# EAGLE design Novo_Container (EAGLE 9.0.1)
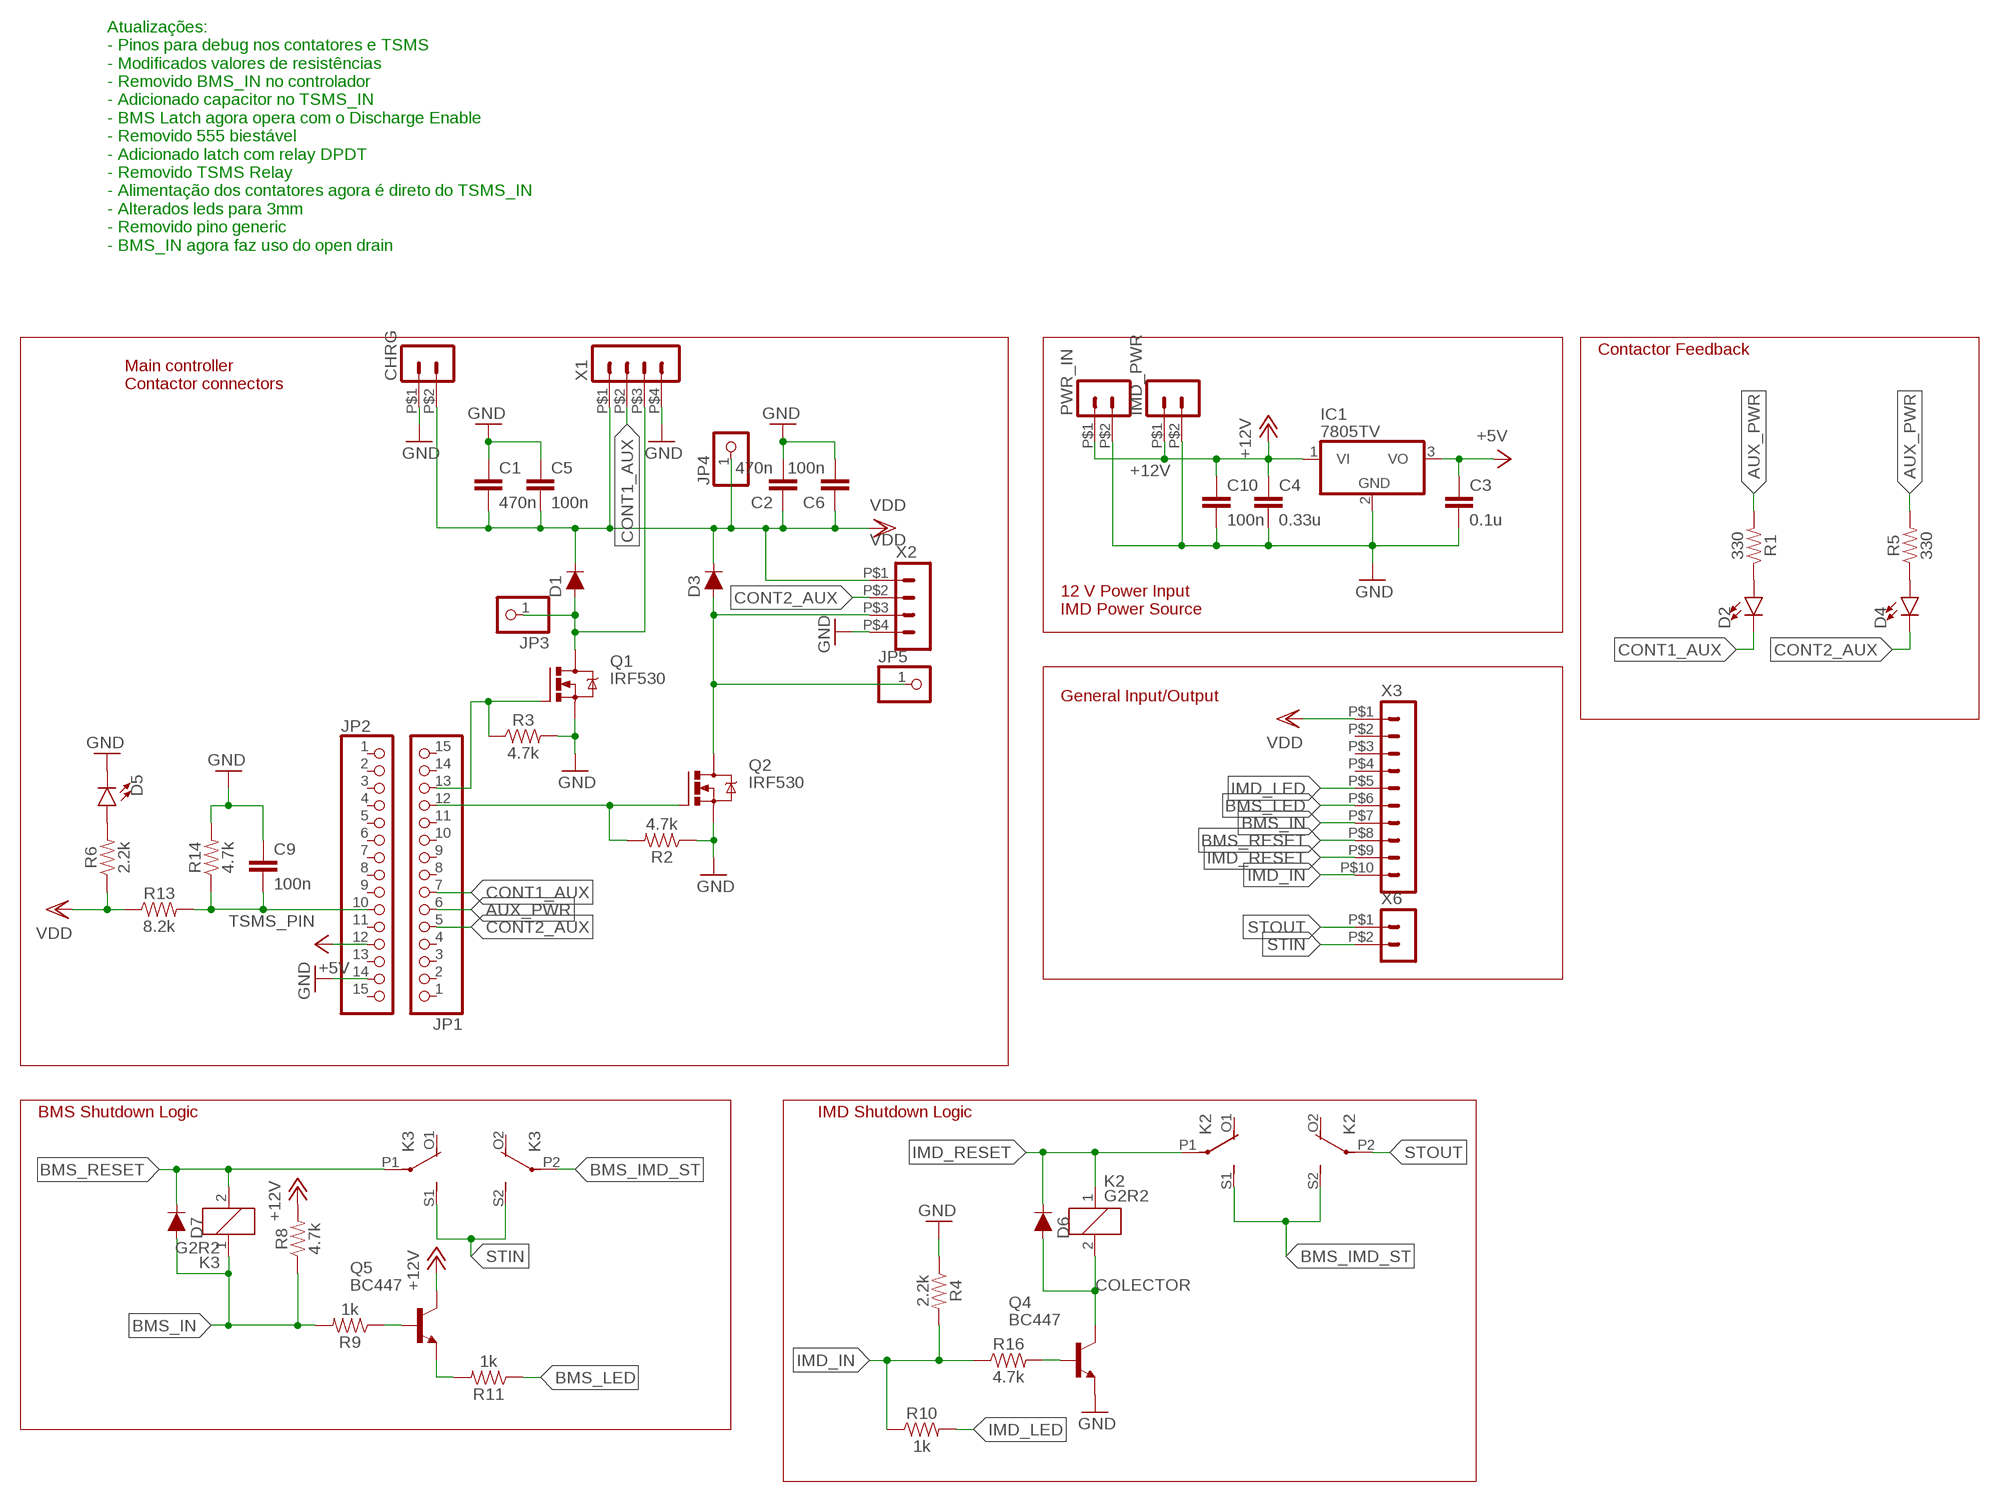
[diagram p0: schematic, sheet 1]

## Parts
C1  470n  C-EU025-025X050  [C025-025X050]
C2  470n  C-EU025-025X050  [C025-025X050]
C3  0.1u  C-EU025-025X050  [C025-025X050]
C4  0.33u  C-EU025-025X050  [C025-025X050]
C5  100n  C-EU025-025X050  [C025-025X050]
C6  100n  C-EU025-025X050  [C025-025X050]
C9  100n  C-EU025-025X050  [C025-025X050]
C10  100n  C-EU025-025X050  [C025-025X050]
CHRG  HEADER_POS2_43650-0200  [43650-0200]
D1  DIODE-1N4148  [DIODE-1N4148]
D2  LED3MM  [LED_3MM]
D3  DIODE-1N4148  [DIODE-1N4148]
D4  LED3MM  [LED_3MM]
D5  LED3MM  [LED_3MM]
D6  DIODE-1N4148  [DIODE-1N4148]
D7  DIODE-1N4148  [DIODE-1N4148]
IC1  7805TV  [TO220V]
IMD_PWR  HEADER_POS2_43650-0200  [43650-0200]
JP1  PINHD-1X15  [1X15]
JP2  PINHD-1X15  [1X15]
JP3  PINHD-1X1  [1X01]
JP4  PINHD-1X1  [1X01]
JP5  PINHD-1X1  [1X01]
K2  G2R2  [G2R2]
K3  G2R2  [G2R2]
PWR_IN  HEADER_POS2_43650-0200  [43650-0200]
Q1  IRF530  [TO220BV]
Q2  IRF530  [TO220BV]
Q4  BC447  [TO92-EBC]
Q5  BC447  [TO92-EBC]
R1  330  RESISTORAXIAL-0.3  [AXIAL-0.3]
R2  4.7k  RESISTORAXIAL-0.3  [AXIAL-0.3]
R3  4.7k  RESISTORAXIAL-0.3  [AXIAL-0.3]
R4  2.2k  RESISTORAXIAL-0.3  [AXIAL-0.3]
R5  330  RESISTORAXIAL-0.3  [AXIAL-0.3]
R6  2.2k  RESISTORAXIAL-0.3  [AXIAL-0.3]
R8  4.7k  RESISTORAXIAL-0.3  [AXIAL-0.3]
R9  1k  RESISTORAXIAL-0.3  [AXIAL-0.3]
R10  1k  RESISTORAXIAL-0.3  [AXIAL-0.3]
R11  1k  RESISTORAXIAL-0.3  [AXIAL-0.3]
R13  8.2k  RESISTORAXIAL-0.3  [AXIAL-0.3]
R14  4.7k  RESISTORAXIAL-0.3  [AXIAL-0.3]
R16  4.7k  RESISTORAXIAL-0.3  [AXIAL-0.3]
X1  HEADER_POS4_43045-0401  [43045-0400]
X2  HEADER_POS4_43045-0401  [43045-0400]
X3  HEADER_POS10_43045-1000  [43045-1000]
X6  HEADER_POS2_43650-0200  [43650-0200]

## Nets
+5V: C3.1 IC1.3(VO) JP2.12
+12V: C4.1 C10.1 IC1.1(VI) IMD_PWR.P$1 PWR_IN.P$1 Q5.C R8.P$2
AUX_PWR: JP1.6 R1.P$2 R5.P$2
BMS_IMD_ST: K2.S1(2:S) K2.S2(3:S) K3.P2(3:P)
BMS_IN: D7.A K3.1 R8.P$1 R9.P$2 X3.P$7
BMS_LED: R11.P$1 X3.P$6
BMS_RESET: D7.C K3.2 K3.P1(2:P) X3.P$8
COLECTOR: D6.A K2.2 Q4.C
CONT1_AUX: D2.K(C) JP1.7 X1.P$2
CONT2_AUX: D4.K(C) JP1.5 X2.P$2
GND: C1.1 C2.2 C3.2 C4.2 C5.1 C6.2 C9.1 C10.2 CHRG.P$1 D5.K(C) IC1.2(GND) IMD_PWR.P$2 JP2.14 PWR_IN.P$2 Q1.S Q2.S Q4.E R2.P$1 R3.P$2 R4.P$1 R14.P$2 X1.P$4 X2.P$4
IMD_IN: R4.P$2 R10.P$1 R16.P$1 X3.P$10
IMD_LED: R10.P$2 X3.P$5
IMD_RESET: D6.C K2.1 K2.P1(2:P) X3.P$9
N$1: D5.A R6.P$2
N$3: D1.A JP3.1 Q1.D X1.P$3
N$4: D3.A JP5.1 Q2.D X2.P$3
N$7: JP1.13 Q1.G R3.P$1
N$8: Q5.B R9.P$1
N$9: JP1.12 Q2.G R2.P$2
N$10: Q5.E R11.P$2
N$12: D2.A R1.P$1
N$13: D4.A R5.P$1
N$15: Q4.B R16.P$2
STIN: K3.S1(2:S) K3.S2(3:S) X6.P$2
STOUT: K2.P2(3:P) X6.P$1
TSMS_PIN: C9.2 JP2.10 R13.P$2 R14.P$1
VDD: C1.2 C2.1 C5.2 C6.1 CHRG.P$2 D1.C D3.C JP4.1 R6.P$1 R13.P$1 X1.P$1 X2.P$1 X3.P$1
Unconnected: JP1.1 JP1.2 JP1.3 JP1.4 JP1.8 JP1.9 JP1.10 JP1.11 JP1.14 JP1.15 JP2.1 JP2.2 JP2.3 JP2.4 JP2.5 JP2.6 JP2.7 JP2.8 JP2.9 JP2.11 JP2.13 JP2.15 K2.O1(2:O) K2.O2(3:O) K3.O1(2:O) K3.O2(3:O) X3.P$2 X3.P$3 X3.P$4

## Notes on the sheet
- Atualizações:
  - Pinos para debug nos contatores e TSMS
  - Modificados valores de resistências
  - Removido BMS_IN no controlador
  - Adicionado capacitor no TSMS_IN
  - BMS Latch agora opera com o Discharge Enable
  - Removido 555 biestável
  - Adicionado latch com relay DPDT
  - Removido TSMS Relay
  - Alimentação dos contatores agora é direto do TSMS_IN
  - Alterados leds para 3mm
  - Removido pino generic
  - BMS_IN agora faz uso do open drain
- Contactor Feedback
- Main controller
  Contactor connectors
- 12 V Power Input
  IMD Power Source
- General Input/Output
- BMS Shutdown Logic | IMD Shutdown Logic

## Library data of the parts
C1-C6 C9 C10 = rcl:C-EU: CAPACITOR, European symbol; SPICEPREFIX: C
CHRG IMD_PWR PWR_IN X6 = con-molex-micro-fit-3_0:HEADER_POS2_?: Molex - Micro-Fit 3.0 Series connector, 3.00mm (0.118") pitch header, 2 positions.
D1 D3 D6 D7 = SparkFun-DiscreteSemi:DIODE: Diode These are standard reverse protection diodes and small signal diodes. SparkFun Products: SparkFun SparkPunk Sound Kit <https://www.sparkfun.com/products/11177> SparkFun ESP8266 Thing <https://www.sparkfun.com/products/13231>; PROD_ID: DIO-08378; VALUE: 200mA/100V/1V
D2 D4 D5 = SparkFun-LED:LED: LED (Generic) Standard schematic elements and footprints for 5mm, 3mm, 1206, and 0603 sized LEDs. Generic LEDs with no color specified.; PROD_ID: DIO-08794
IC1 = linear:78*: Positive VOLTAGE REGULATOR Source: http://cache.national.com/ds/LM/LM78L05.pdf http://www.fairchildsemi.com/ds/LM/LM7805.pdf
JP1 JP2 = pinhead:PINHD-1X15: PIN HEADER
JP3-JP5 = pinhead:PINHD-1X1: PIN HEADER
K2 K3 = relay:G2R2: RELAY 2 x switch, Omron; MF: OMRON COMPONENTS USA; MPN: G2R-2-DC6; OC_FARNELL: unknown; OC_NEWARK: 89C5317
Q1 Q2 = transistor-power:IRF530: HEXFET Power MOSFET
Q4 Q5 = transistor-npn:BC447*: NPN Transistor
R1-R6 R8-R11 R13 R14 R16 = SparkFun-Resistors:RESISTOR: Generic Resistor Package
X1 X2 = con-molex-micro-fit-3_0:HEADER_POS4_?: Molex - Micro-Fit 3.0 Series connector, 3.00mm (0.118") pitch header, 4 positions.
X3 = con-molex-micro-fit-3_0:HEADER_POS10_?: Molex - Micro-Fit 3.0 Series connector, 3.00mm (0.118") pitch header, 10 positions.

## Board
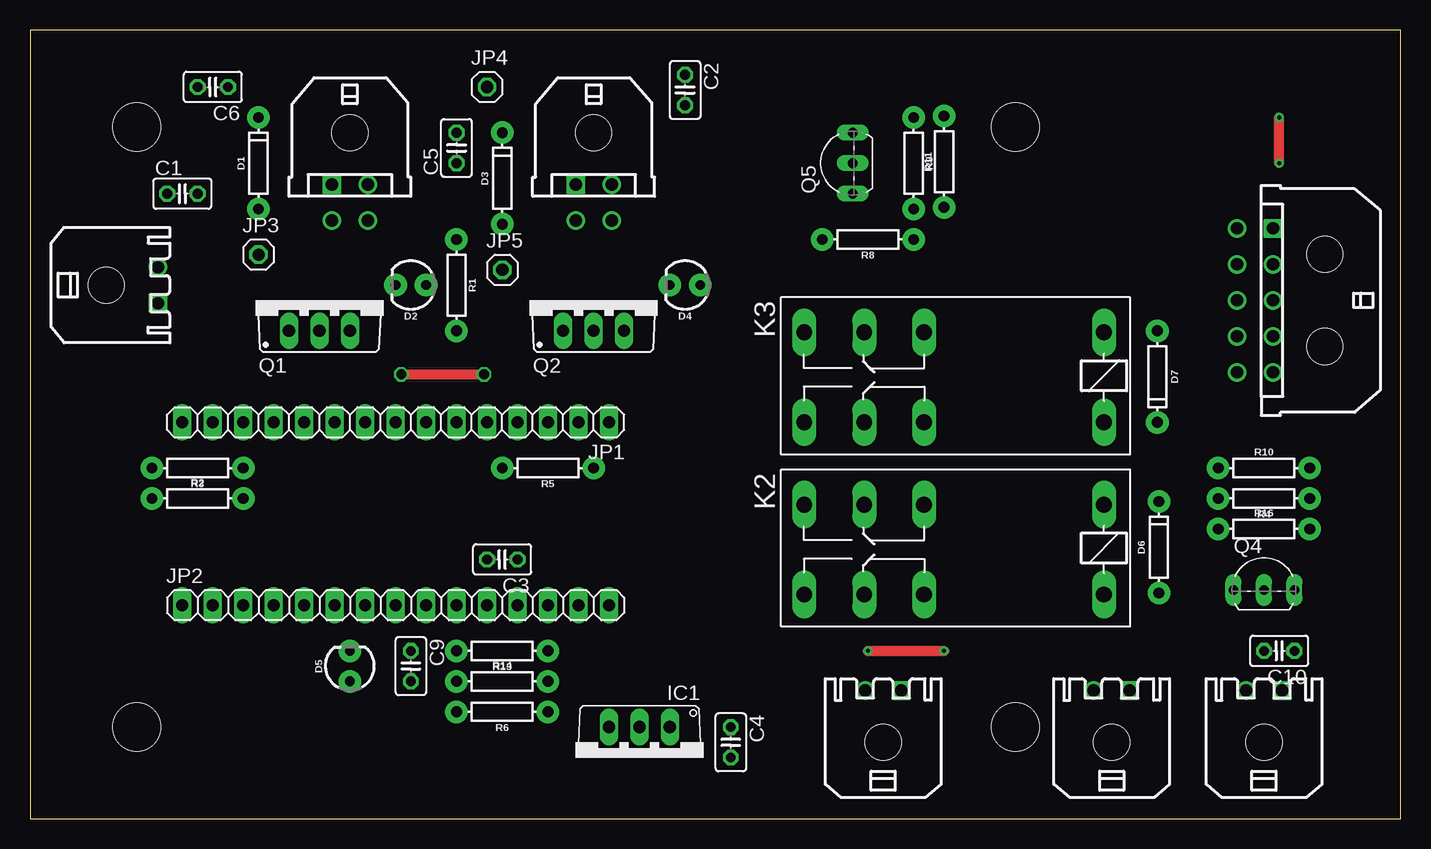
[diagram p1: board, top side]
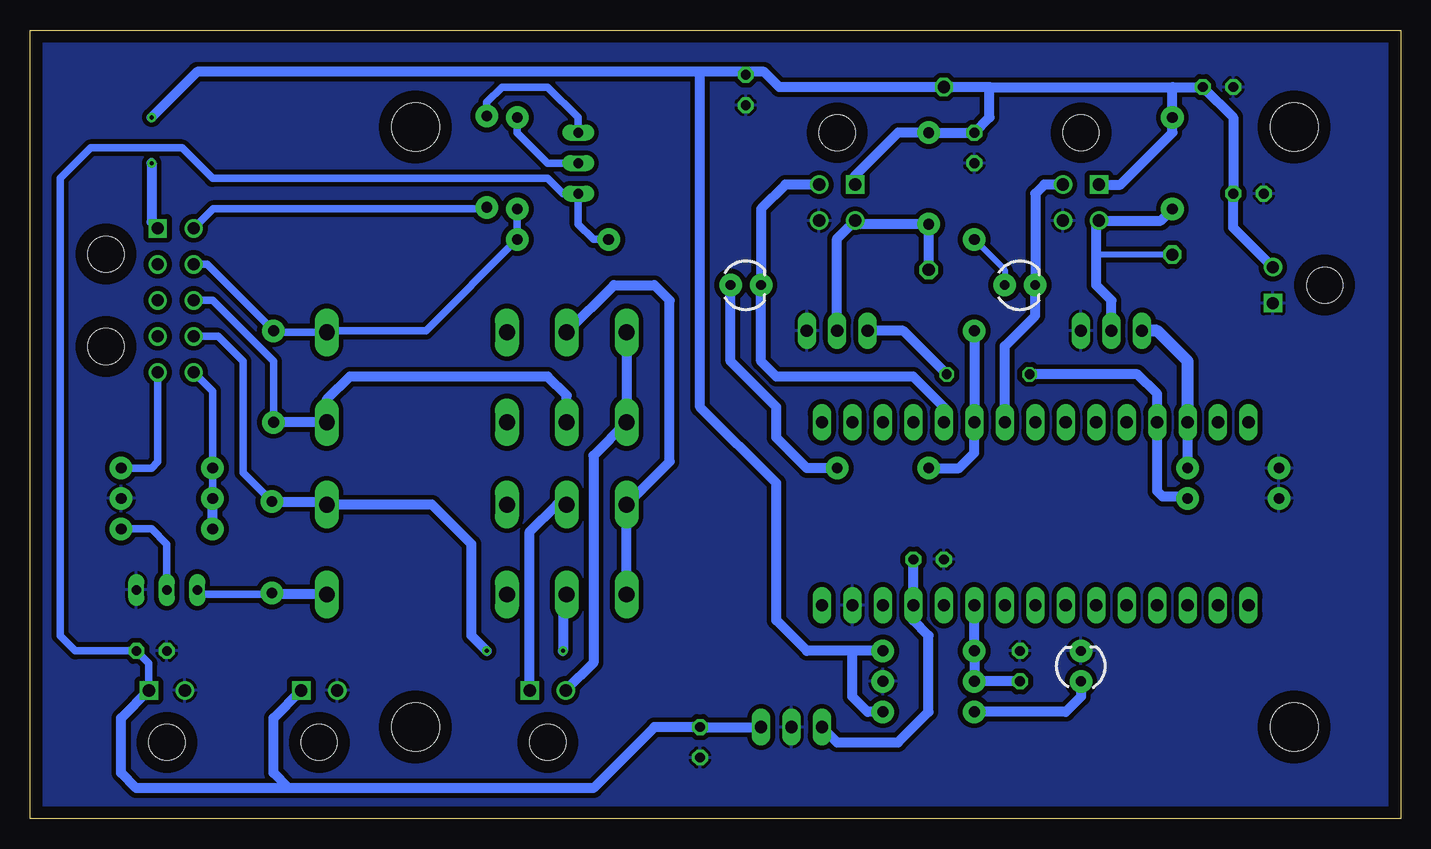
[diagram p2: board, bottom side, seen from below]

Size 114.28 x 65.71 mm. Coordinates in mm from the lower left corner, seen from the top.
Outline: 0,0 114.28,0 114.28,65.71 0,65.71 0,0
Copper layers (1*16): Top 0.035mm / dielectric 1.5mm / Bottom 0.035mm
Design rules "default": minimum track width 6mil, minimum drill 0.35mm, track to track 6mil, track to pad 6mil, pad to pad 6mil, via to via 6mil, smd to smd 6mil, copper to edge 40mil, drill to drill 6mil, minimum pad ring 10mil, minimum via ring 8mil, stop-mask expansion 4mil, vias tented up to drill 0mil, thermal gap 10mil
Holes 4 mm at 8.89,57.62 8.89,7.62 82.14,7.62 82.14,57.62

### Footprints (pad centres in the part's own frame; a part is rotated, then mirrored left to right if it is on the bottom)
C025-025X050 = drill 0.813 octagon: 1 -1.27,0; 2 1.27,0
43650-0200 = drill 1.02 square: P$1 1.5,4.32 | drill 1.02: P$2 -1.5,4.32 | hole 3: 0,0
DIODE-1N4148 = drill 0.9 pad 1.88: A -3.81,0; C 3.81,0
LED_3MM = drill 0.813 pad 1.88: A -1.27,0; K 1.27,0
TO220V = drill 1.016 long: 1 -2.54,-2.54; 2 0,-2.54; 3 2.54,-2.54
1X15 = drill 1.016 long: 1 -17.78,0; 2 -15.24,0; 3 -12.7,0; 4 -10.16,0; 5 -7.62,0; 6 -5.08,0; 7 -2.54,0; 8 0,0; 9 2.54,0; 10 5.08,0; 11 7.62,0; 12 10.16,0; 13 12.7,0; 14 15.24,0; 15 17.78,0
1X01 = drill 1.016 octagon: 1 0,0
G2R2 = drill 1.321 long: 1 -2.54,-3.683; 2 -2.54,3.81; O1 12.471,3.81; O2 12.471,-3.683; P1 17.45,3.81; P2 17.45,-3.683; S1 22.454,3.81; S2 22.454,-3.683
TO220BV = drill 1.016 long: D 0,-2.54; G -2.54,-2.54; S 2.54,-2.54
TO92-EBC = drill 0.813 long: B 0,-1.27; C -2.54,-1.27; E 2.54,-1.27
AXIAL-0.3 = drill 0.9 pad 1.88: P$1 -3.81,0; P$2 3.81,0
43045-0400 = drill 1.02 square: P$1 1.5,4.32 | drill 1.02: P$2 -1.5,4.32; P$3 1.5,7.32; P$4 -1.5,7.32 | hole 3: 0,0
43045-1000 = drill 1.02 square: P$1 6,4.32 | drill 1.02: P$2 3,4.32; P$3 0,4.32; P$4 -3,4.32; P$5 -6,4.32; P$6 6,7.32; P$7 3,7.32; P$8 0,7.32; P$9 -3,7.32; P$10 -6,7.32 | hole 3: 3.85,0; -3.85,0

### Placement (x,y rotation side)
C1  12.7,52.07 0 top
C2  54.61,60.71 270 top
C3  39.37,21.59 180 top
C4  58.42,6.35 270 top
C5  35.56,55.88 90 top
C6  15.24,60.96 180 top
C9  31.75,12.7 270 top
C10  104.14,13.97 180 top
CHRG  6.35,44.45 270 top
D1  19.05,54.61 90 top
D2  31.75,44.45 180 top
D3  39.37,53.34 90 top
D4  54.61,44.45 180 top
D5  26.67,12.7 90 top
D6  94.11,22.61 90 top
D7  93.98,36.83 270 top
IC1  50.8,5.08 180 top
IMD_PWR  102.87,6.35 0 top
JP1  30.48,33.02 180 top
JP2  30.48,17.78 0 top
JP3  19.05,46.99 0 top
JP4  38.1,60.96 0 top
JP5  39.37,45.72 0 top
K2  86.99,22.48 180 top
K3  86.99,36.83 180 top
PWR_IN  90.17,6.35 0 top
Q1  24.13,43.18 0 top
Q2  46.99,43.18 0 top
Q4  102.87,20.32 0 top
Q5  67.31,54.61 90 top
R1  35.56,44.45 270 top
R2  13.97,26.67 0 top
R3  13.97,29.21 180 top
R4  102.87,26.67 180 top
R5  43.18,29.21 180 top
R6  39.37,8.89 180 top
R8  69.85,48.26 180 top
R9  73.66,54.61 270 top
R10  102.87,29.21 0 top
R11  76.2,54.74 90 top
R13  39.37,13.97 180 top
R14  39.37,11.43 0 top
R16  102.87,24.13 0 top
X1  26.67,57.15 180 top
X2  46.99,57.15 180 top
X3  107.95,43.18 90 top
X6  71.12,6.35 0 top

### Tracks (layer width: path | path; a pad name or v marks a point on that pad's centre or on a via)
+5V
  Bottom 0.813: C3.1 JP2.12 40.64,16.51 39.37,15.24 39.37,8.89 41.91,6.35 46.99,6.35 IC1.3
+12V
  Bottom 0.61: IMD_PWR.P$1 104.37,12.93 C10.1 110.49,13.97 111.76,15.24 111.76,53.34 109.22,55.88 101.6,55.88 99.06,53.34 71.12,53.34 69.85,52.07 Q5.C 68.58,49.53 67.31,48.26 R8.P$2
  Bottom 0.813: IC1.1 C4.1 62.23,7.62 67.31,2.54 92.71,2.54 | 92.71,2.54 93.98,3.81 93.98,8.36 PWR_IN.P$1 | IMD_PWR.P$1 106.68,8.36 106.68,3.81 105.41,2.54 92.71,2.54
AUX_PWR
  Bottom 0.813: R5.P$2 36.83,29.21 35.56,30.48 JP1.6 R1.P$2
BMS_IMD_ST
  Bottom 0.813: K2.S1 K2.S2 60.96,29.74 60.96,43.18 62.23,44.45 65.61,44.45 K3.P2
BMS_IN
  Bottom 0.61: D7.A 93.85,40.51 | R9.P$2 R8.P$1 81.28,40.64 89.41,40.64 K3.1 93.85,40.51 | 93.85,40.51 D7.A | D7.A 99.06,45.72 | 99.06,45.72 99.52,46.18 | 99.06,45.72 99.52,46.18 | 99.52,46.18 X3.P$7
BMS_LED
  Bottom 0.61: R11.P$1 76.33,50.8 99.01,50.8 X3.P$6
BMS_RESET
  Bottom 0.61: D7.C 93.98,38.1 99.06,43.18 X3.P$8
  Bottom 0.813: K3.P1 69.55,35.26 71.12,36.83 87.63,36.83 89.53,34.92 K3.2 D7.C
COLECTOR
  Bottom 0.61: Q4.C 99.95,18.67 93.98,18.67
  Bottom 0.813: K2.2 93.98,18.67 | 93.98,18.67 D6.A | 93.98,18.67 94.36,18.67
CONT1_AUX
  Bottom 0.813: JP1.7 33.02,39.37 30.48,41.91 D2.K 30.48,52.07 29.72,52.83 X1.P$2
CONT2_AUX
  Bottom 0.813: JP1.5 38.1,34.29 40.64,36.83 52.07,36.83 53.34,38.1 D4.K 53.34,50.8 51.31,52.83 X2.P$2
GND
  pour Bottom (isolate 0.406): 0,0 0,66.04 118.11,66.04 118.11,0
IMD_IN
  Bottom 0.61: R4.P$2 R10.P$1 99.06,35.61 X3.P$10
  Bottom 0.813: R16.P$1 R4.P$2
IMD_LED
  Bottom 0.61: X3.P$5 103.63,29.72 104.14,29.21 R10.P$2
IMD_RESET  (via drill 0.35)
  Top 0.813: v69.85,13.97 v76.2,13.97
  Bottom 0.61: D6.C 96.52,28.83 96.52,38.1 98.6,40.18 X3.P$9
  Bottom 0.813: D6.C 89.79,26.42 K2.1 80.77,26.16 77.47,22.86 77.47,15.24 v76.2,13.97 | K2.P1 69.85,18.36 v69.85,13.97
N$1
  Bottom 0.813: D5.A 26.67,10.16 27.94,8.89 R6.P$2
N$3
  Bottom 0.508: JP3.1 25.4,46.99
  Bottom 0.813: Q1.D 24.13,43.18 25.4,44.45 25.4,46.99 25.4,49.6 X1.P$3 20.02,49.83 D1.A
N$4
  Bottom 0.813: JP5.1 D3.A 45.19,49.53 X2.P$3 46.99,48.33 Q2.D
N$7
  Bottom 0.813: R3.P$1 JP1.13
  Bottom 1.016: Q1.G 20.32,40.64 17.78,38.1 JP1.13
N$8
  Bottom 0.61: R9.P$1 73.66,57.15 71.12,54.61 Q5.B
N$9  (via drill 0.8)
  Top 0.813: v30.95,37.02 v37.85,37.02
  Bottom 0.813: R2.P$2 17.93,26.82 19.85,26.82 20.32,27.29 JP1.12 20.32,35.39 21.95,37.02 v30.95,37.02 | v37.85,37.02 41.47,40.64 Q2.G
N$10
  Bottom 0.61: Q5.E 68.58,58.42 71.12,60.96 74.93,60.96 76.2,59.69 R11.P$2
N$12
  Bottom 0.508: R1.P$1 33.02,45.72 D2.A
N$13
  Bottom 0.813: D4.A 55.88,38.1 52.07,34.29 52.07,31.75 49.53,29.21 R5.P$1
N$15
  Bottom 0.61: R16.P$2 104.14,24.13 102.87,22.86 Q4.B
STIN
  Bottom 0.813: K3.S2 K3.S1 67.31,30.25 67.31,12.98 X6.P$2
STOUT
  Bottom 0.813: X6.P$1 72.62,23.9 70.36,26.16 K2.P2
TSMS_PIN
  Bottom 0.813: C9.2 R14.P$1 R13.P$2 JP2.10
VDD  (via drill 0.35)
  Top 0.813: v104.14,54.61 v104.14,58.42
  Bottom 0.813: 34.29,60.96 JP4.1 51.82,60.96 53.09,62.23 54.61,62.23 | X2.P$1 45.49,53.57 41.91,57.15 D3.C C5.2 34.29,58.42 34.29,60.96 | X1.P$1 23.37,52.83 19.05,57.15 D1.C 19.05,60.96 | R13.P$1 45.72,13.97 | 45.72,13.97 49.53,13.97 52.07,16.51 52.07,27.94 58.42,34.29 58.42,62.23 | R6.P$1 44.45,8.89 45.72,10.16 45.72,13.97 | CHRG.P$2 13.97,49.25 C1.2 13.97,58.42 C6.1 19.05,60.96 | v104.14,58.42 100.33,62.23 58.42,62.23 | X3.P$1 104.14,49.69 v104.14,54.61 | 54.61,62.23 58.42,62.23 | C2.1 54.61,62.23 | 34.29,60.96 19.05,60.96